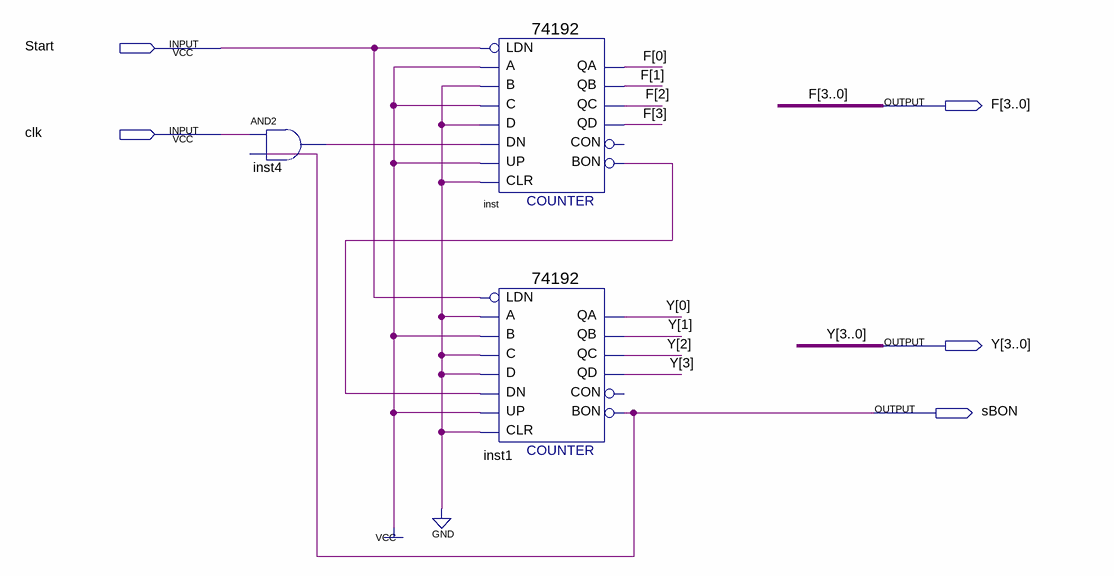
[diagram p0: schematic sheet]
// Quartus schematic lab2.bdf as structural Verilog: 3 symbols, 5 pins
module lab2 (
  input  Start,
  input  clk,
  output [3:0] F,
  output [3:0] Y,
  output sBON
);

  wire inst4_out, inst_bon;

  and inst4 (inst4_out, clk, sBON);
  \74192  inst (
    .D(1'b0), .C(1'b1), .A(1'b1), .B(1'b0), .CLR(1'b0), .UP(1'b1), .DN(inst4_out), .LDN(Start), .QB(F[1]),
    .BON(inst_bon), .QA(F[0]), .QC(F[2]), .QD(F[3]));  // open: CON
  \74192  inst1 (
    .D(1'b0), .C(1'b0), .A(1'b0), .B(1'b1), .CLR(1'b0), .UP(1'b1), .DN(inst_bon), .LDN(Start), .QB(Y[1]),
    .BON(sBON), .QA(Y[0]), .QC(Y[2]), .QD(Y[3]));  // open: CON
endmodule
